# EAGLE design soft_starter_schematics (EAGLE 9.6.2)
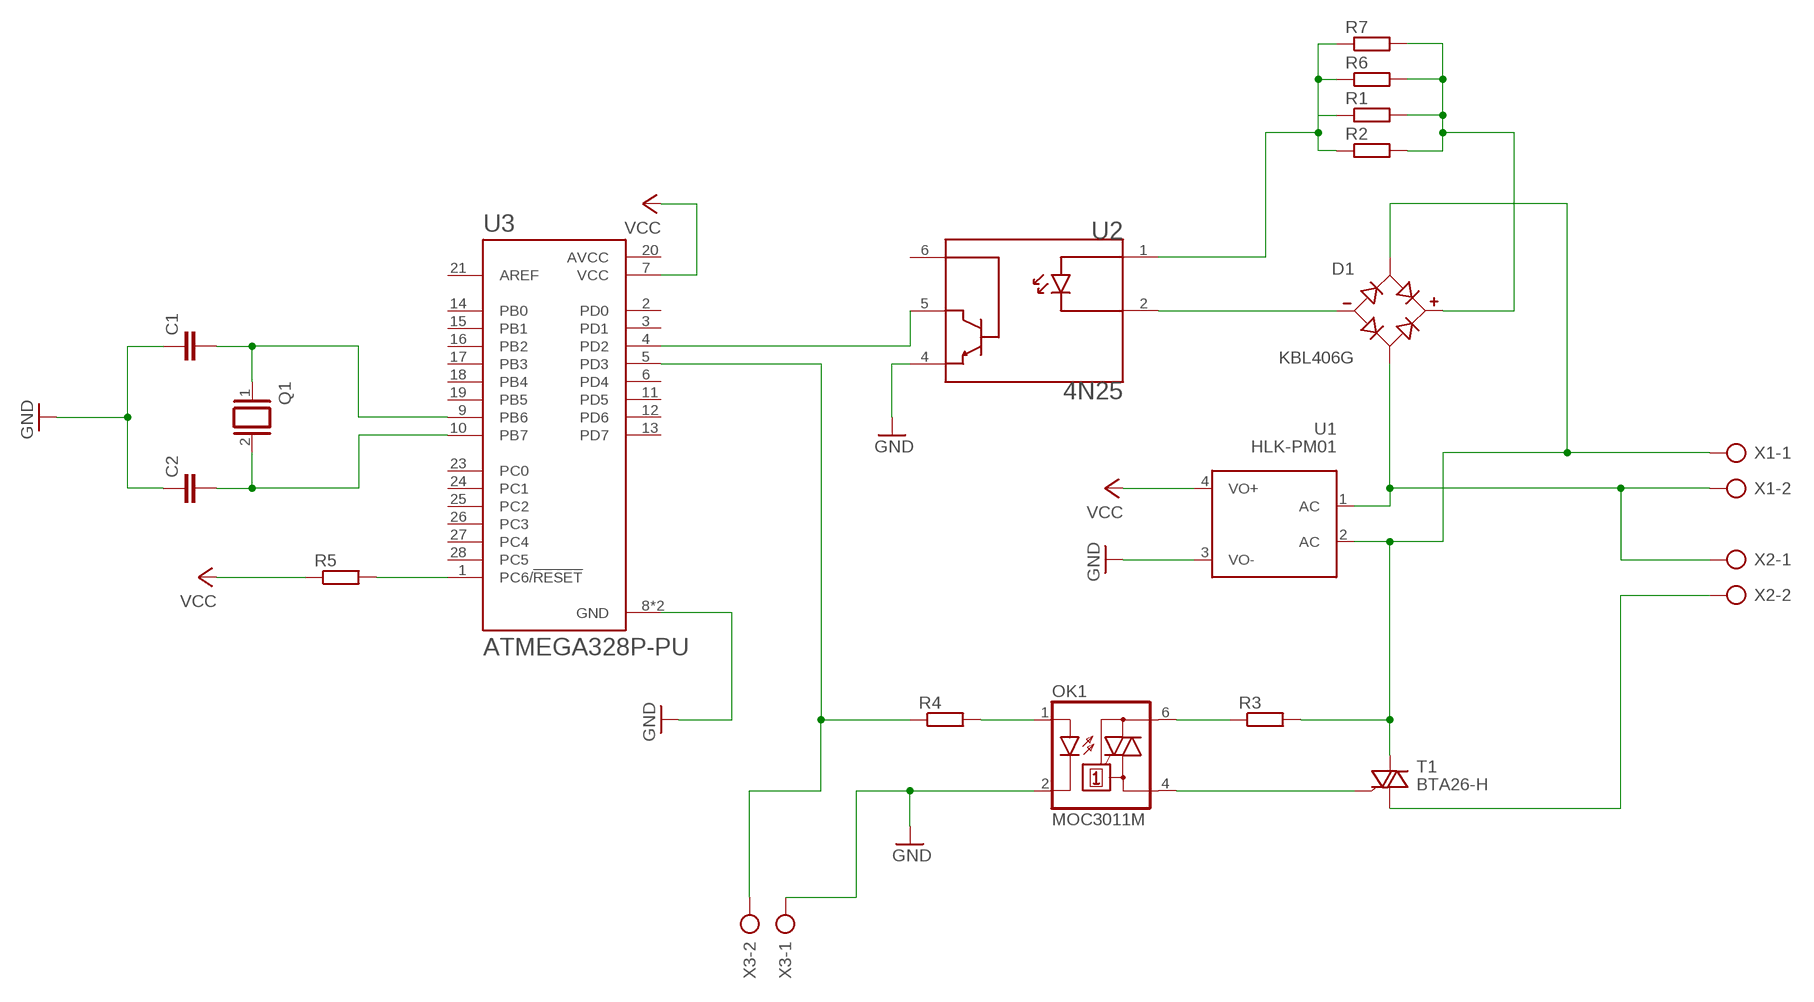
[diagram p0: schematic, sheet 1]

## Parts
C1  C2.5/2  [C2.5-2]
C2  C2.5/2  [C2.5-2]
D1  KBL406G  [SIP600W130P510L1900H1630Q4]
OK1  MOC3011M  [DIL06]
Q1  XTAL/S  [QS]
R1  R-EU_0207/10  [0207/10]
R2  R-EU_0207/10  [0207/10]
R3  R-EU_0207/10  [0207/10]
R4  R-EU_0207/10  [0207/10]
R5  R-EU_0207/10  [0207/10]
R6  R-EU_0207/10  [0207/10]
R7  R-EU_0207/10  [0207/10]
T1  BTA26-H  [TOP3L-1]
U1  HLK-PM01  [HLK-PM01]
U2  4N25  [DIP762W50P254L712H400Q6N]
U3  ATMEGA328P-PU  [DIP794W46P254L2967H457Q28B]
X1  AK300/2  [AK300/2]
X2  AK300/2  [AK300/2]
X3  AK300/2  [AK300/2]

## Nets
GND: C1.1 C2.1 OK1.2(C) U1.3(VO-) U2.4(E) U3.8(GND) U3.22(GND) X3.1
N$1: U2.5(C) U3.4(PD2)
N$2: D1.- U2.2(K)
N$3: D1.+ R1.2 R2.2 R6.2 R7.2
N$4: R1.1 R2.1 R6.1 R7.1 U2.1(A)
N$5: D1.AC2 U1.1(AC) X1.2 X2.1
N$6: R4.1 U3.5(PD3) X3.2
N$7: T1.A1 X2.2
N$8: OK1.4(A1) T1.G
N$9: OK1.6(A2) R3.1
N$10: R5.2 U3.1(PC6/!RESET)
N$11: OK1.1(A) R4.2
N$12: C2.2 Q1.2 U3.10(PB7)
N$13: C1.2 Q1.1 U3.9(PB6)
N$16: D1.AC1 R3.2 T1.A2 U1.2(AC) X1.1
VCC: R5.1 U1.4(VO+) U3.7(VCC)
Unconnected: U2.6(B) U3.2(PD0) U3.3(PD1) U3.6(PD4) U3.11(PD5) U3.12(PD6) U3.13(PD7) U3.14(PB0) U3.15(PB1) U3.16(PB2) U3.17(PB3) U3.18(PB4) U3.19(PB5) U3.21(AREF) U3.23(PC0) U3.24(PC1) U3.25(PC2) U3.26(PC3) U3.27(PC4) U3.28(PC5)

## Power pins joined to a net without a drawn wire
AVCC: U3.20(AVCC)

## Library data of the parts
C1 C2 = capacitor-wima:C: CAPACITOR naming: grid - package width
D1 = KBL406G:KBL406G: Check availability <https://pricing.snapeda.com/parts/KBL406-G/Comchip%20Technology/view-part?ref=eda>; AVAILABILITY: In Stock; DESCRIPTION: Bridge Rectifier Single Phase Standard 600 V Through Hole KBL; MF: Comchip Technology; MP: KBL406-G; PACKAGE: SIP-4 Comchip; PRICE: None; PURCHASE-URL: https://pricing.snapeda.com/search/part/KBL406-G/?ref=eda
OK1 = optocoupler:MOC30*M: RANDOM-PHASE OPTOISOLATORS TRIAC DRIVER OUTPUT Source: http://www.fairchildsemi.com MOC3020-M.pdf; MF: FAIRCHILD SEMICONDUCTOR; MPN: MOC3011-M; OC_FARNELL: 1021363; OC_NEWARK: 72K8893
Q1 = special:XTAL/S: CRYSTAL
R1-R7 = rcl:R-EU_: RESISTOR, European symbol; SPICEPREFIX: R
T1 = triac:BTA26: 25A TRIAC Source: http://www.st.com/stonline/products/literature/ds/7470.pdf
U1 = HLK-PM01:HLK-PM01: Check availability <https://pricing.snapeda.com/parts/hlk-pm01/Hi-link/view-part?ref=eda>; AVAILABILITY: In Stock; DESCRIPTION: The 3W ultra-small series module power supply is a small-volume, high-efficiency AC DC power module supply designed by Shenzhen Hi-Link Electronics Co.,Ltd. It has the advantages of global input voltage range, low temperature rise, low power consumption,high efficiency, high reliability and high safety isolation. It has been widely used in smart home, automation control, communications equipment, instrumentation and other industries.; MF: Hi-link; MP: hlk-pm01; PACKAGE: None; PRICE: None
U2 = 4N25:4N25: Optoisolator, Transistor Output Check availability <https://pricing.snapeda.com/parts/4N25/Vishay%20Semiconductor%20Opto%20Division/view-part?ref=eda>; AVAILABILITY: In Stock; DESCRIPTION: Optoisolator Transistor with Base Output 5000Vrms 1 Channel 6-DIP; MF: Vishay Semiconductor Opto Division; MP: 4N25; PACKAGE: None; PRICE: None; PURCHASE-URL: https://pricing.snapeda.com/search/part/4N25/?ref=eda
U3 = ATMEGA328P-PU:ATMEGA328P-PU: ATmega Series 20 MHz 32 KB Flash 2 KB SRAM 8-Bit Microcontroller - DIP-28 Check availability <https://pricing.snapeda.com/parts/ATMEGA328P-PU/Microchip/view-part?ref=eda>; AVAILABILITY: In Stock; DESCRIPTION: AVR AVR® ATmega Microcontroller IC 8-Bit 20MHz 32KB (16K x 16) FLASH 28-PDIP; MF: Microchip; MP: ATMEGA328P-PU; PACKAGE: PDIP-28 Atmel; PRICE: None; PURCHASE-URL: https://pricing.snapeda.com/search/part/ATMEGA328P-PU/?ref=eda
X1-X3 = con-ptr500:AK300/2: CONNECTOR; OC_FARNELL: unknown; OC_NEWARK: unknown

## Board
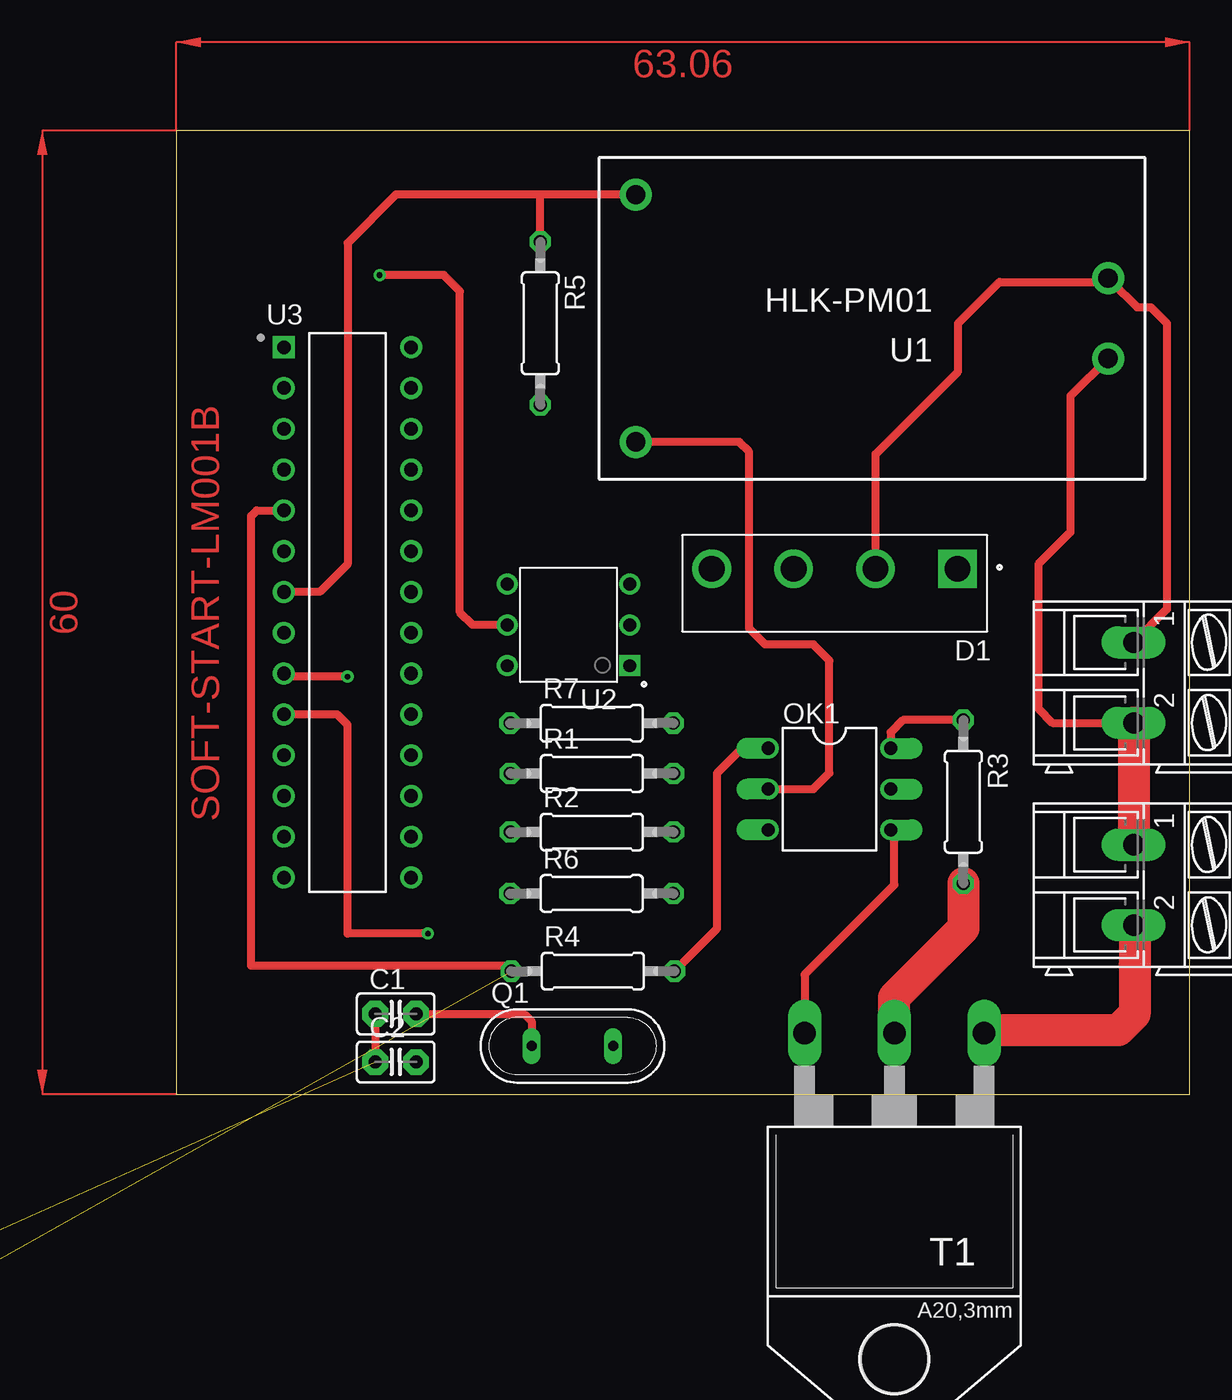
[diagram p1: board, top side]
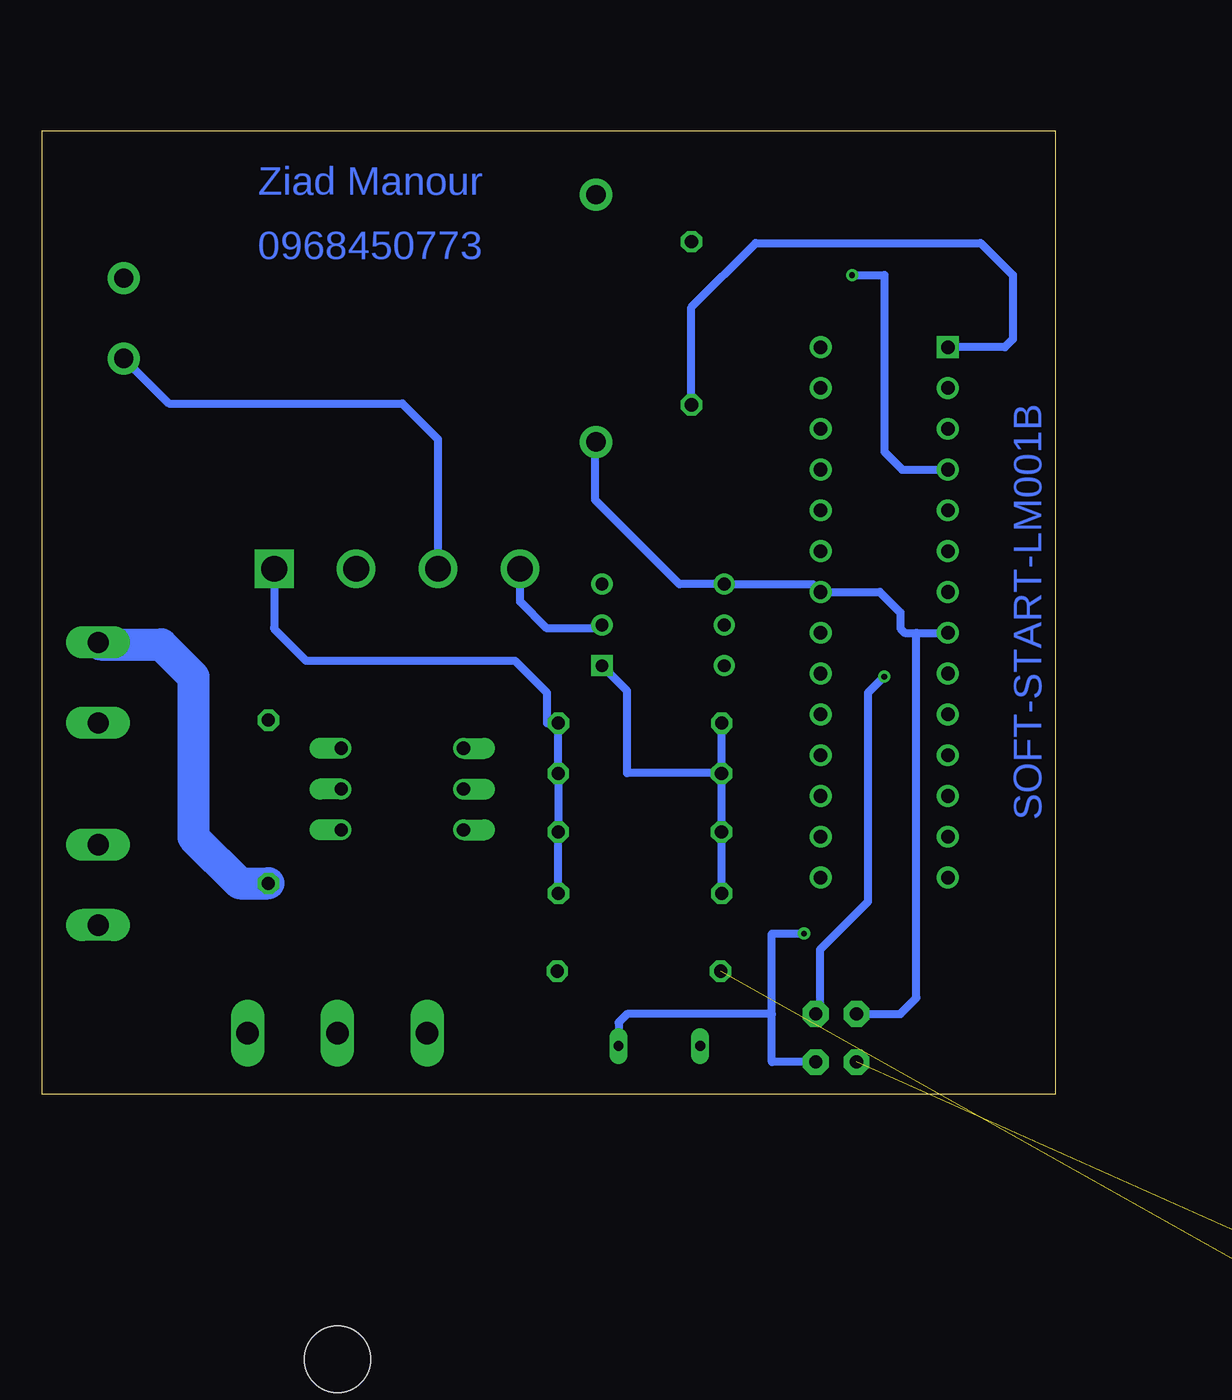
[diagram p2: board, bottom side, seen from below]

Size 63.06 x 60 mm. Coordinates in mm from the lower left corner, seen from the top.
Outline: 0,0 63.06,0 63.06,60 0,60 0,0
Copper layers (1*16): Top 0.035mm / dielectric 1.5mm / Bottom 0.035mm
Design rules "default": minimum track width 6mil, minimum drill 0.35mm, track to track 6mil, track to pad 6mil, pad to pad 6mil, via to via 6mil, smd to smd 6mil, copper to edge 40mil, drill to drill 6mil, minimum pad ring 10mil, minimum via ring 8mil, stop-mask expansion 4mil, vias tented up to drill 0mil, thermal gap 10mil

### Footprints (pad centres in the part's own frame; a part is rotated, then mirrored left to right if it is on the bottom)
C2.5-2 = drill 0.813 pad 1.6 octagon: 1 -1.27,0; 2 1.27,0
SIP600W130P510L1900H1630Q4 = drill 1.6 square: + -7.65,-0.9 | drill 1.6: - 7.65,-0.9; AC1 -2.55,-0.9; AC2 2.55,-0.9
DIL06 = drill 0.813 offset: 1 -2.54,-3.81; 2 0,-3.81; 3 2.54,-3.81; 4 2.54,3.81; 5 0,3.81; 6 -2.54,3.81
QS = drill 0.61 long: 1 -2.54,0; 2 2.54,0
0207/10 = drill 0.813 octagon: 1 -5.08,0; 2 5.08,0
TOP3L-1 = drill 1.397 long: A1 -5.588,-7.62; A2 0,-7.62; G 5.588,-7.62 | hole 4.115: 0,12.7
HLK-PM01 = drill 1.2 pad 2: 1 -14.7,2.5; 2 -14.7,-2.5; 3 14.7,7.7; 4 14.7,-7.7
DIP762W50P254L712H400Q6N = drill 0.8 square: 1 -3.81,2.54 | drill 0.8: 2 -3.81,0; 3 -3.81,-2.54; 4 3.81,-2.54; 5 3.81,0; 6 3.81,2.54
DIP794W46P254L2967H457Q28B = drill 0.85 square: 1 -3.96,16.51 | drill 0.85: 2 -3.96,13.97; 3 -3.96,11.43; 4 -3.96,8.89; 5 -3.96,6.35; 6 -3.96,3.81; 7 -3.96,1.27; 8 -3.96,-1.27; 9 -3.96,-3.81; 10 -3.96,-6.35; 11 -3.96,-8.89; 12 -3.96,-11.43; 13 -3.96,-13.97; 14 -3.96,-16.51; 15 3.96,-16.51; 16 3.96,-13.97; 17 3.96,-11.43; 18 3.96,-8.89; 19 3.96,-6.35; 20 3.96,-3.81; 21 3.96,-1.27; 22 3.96,1.27; 23 3.96,3.81; 24 3.96,6.35; 25 3.96,8.89; 26 3.96,11.43; 27 3.96,13.97; 28 3.96,16.51
AK300/2 = drill 1.321 long: 1 -2.515,0; 2 2.489,0

### Placement (x,y rotation side)
C1  13.65,5 0 top
C2  13.65,2 0 top
D1  40.97,31.81 180 top
OK1  40.65,19 270 top
Q1  24.65,3 0 top
R1  25.86,19.97 0 top
R2  25.86,16.32 0 top
R3  48.98,18.21 270 top
R4  25.92,7.66 0 top
R5  22.65,48 270 top
R6  25.85,12.5 0 top
R7  25.85,23.1 0 top
T1  44.69,-3.81 180 top
U1  43.29,48.31 180 top
U2  24.41,29.22 180 top
U3  10.65,30 0 top
X1  59.58,25.61 270 top
X2  59.58,13.02 270 top
X3  -17.15,-12.3 0 top  (outside the outline)

### Tracks (layer width: path | path; a pad name or v marks a point on that pad's centre or on a via)
GND  (1 unrouted)
  Top 0.5: U1.3 35.04,40.61 35.65,40 35.65,29 36.65,28 39.65,28 40.65,27 40.65,20 39.65,19 OK1.2 | C1.1 C2.1
  Bottom 0.152: 28.65,40.67 U1.3
  Bottom 0.5: 28.65,40.67 28.65,37 23.41,31.76 U2.4 15.1,31.76 U3.22 10.92,31.27 9.65,30 9.65,29 9.38,28.73 8.65,28.73 | 8.65,28.73 U3.8 | C1.1 9.65,5 8.65,6 8.65,28.73
N$1  (via drill 0.35)
  Top 0.5: U2.5 18.43,29.22 17.65,30 17.65,50 16.65,51 v12.65,51
  Bottom 0.5: v12.65,51 10.65,51 10.65,40 9.54,38.89 U3.4
N$2
  Bottom 0.152: U2.2 28.44,29
  Bottom 0.5: 28.44,29 31.65,29 33.32,30.67 D1.-
N$3
  Bottom 0.152: 48.62,29.03 48.65,29
  Bottom 0.5: D1.+ 48.62,29.03 | 48.65,29 46.65,27 33.65,27 31.65,25 31.65,23.1 R7.2 R1.2 R2.2 R6.2
N$4
  Top 0.152: 20.73,16.42 R2.1 20.88,16.27 | 20.88,20.02 R1.1
  Bottom 0.152: R1.1 20.81,20
  Bottom 0.5: 20.81,20 26.65,20 26.65,25.11 U2.1 | R6.1 R2.1 R1.1 R7.1
N$5
  Top 0.152: X2.1 59.55,15.56
  Top 0.5: U1.1 55.65,43.47 55.65,35 53.65,33 53.65,24 54.53,23.12 X1.2
  Top 2: X1.2 X2.1
  Bottom 0.152: 59.55,15.56 X2.1
  Bottom 0.5: D1.AC2 38.42,40.77 40.65,43 55.18,43 U1.1
N$6  (1 unrouted)
  Top 0.5: R4.1 20.5,8 4.65,8 4.65,36 5,36.35 U3.5
N$7
  Top 0.152: T1.A1 50.47,4 | X2.2 59.65,10.46
  Top 2: 50.47,4 58.65,4 59.65,5 59.65,8 59.65,10.46
N$8
  Top 0.152: T1.G 39.15,3.81 | 44.69,16.23 OK1.4
  Top 0.5: T1.G 39.1,7.45 44.69,13.04 44.69,16.23
N$9
  Top 0.5: R3.1 45.22,23.29 44.46,22.53 OK1.6
N$10
  Bottom 0.5: U3.1 3.14,46.51 2.65,47 2.65,51 4.65,53 18.65,53 22.65,49 R5.2
N$11
  Top 0.5: R4.2 33.65,10.31 33.65,20 35.19,21.54 OK1.1
N$12  (via drill 0.35)
  Top 0.5: v15.65,10 10.65,10 10.65,23 10,23.65 U3.10
  Bottom 0.5: C2.2 17.65,2 17.65,5 | 17.65,5 26.65,5 27.19,4.46 Q1.2 | 17.65,5 17.65,10 v15.65,10
N$13  (via drill 0.35)
  Top 0.152: 6.88,26 U3.9
  Top 0.5: C1.2 21.65,5 22.11,4.54 Q1.1 | v10.65,26 6.88,26
  Bottom 0.152: C1.2 14.65,5.27
  Bottom 0.5: 14.65,5.27 14.65,9 11.65,12 11.65,25 v10.65,26
N$16
  Top 0.152: 44.65,3.85 T1.A2 | U1.2 58.23,50.58
  Top 0.5: X1.1 61.65,30.2 61.65,48 60.65,49 59.8,49 58.23,50.58 51.23,50.58 48.65,48 48.65,45 43.52,39.87 D1.AC1
  Top 2: R3.2 48.98,10.33 44.65,6 44.65,3.85
  Bottom 0.152: X1.1 59.46,28
  Bottom 2: 59.46,28 55.65,28 53.65,26 53.65,16 50.78,13.13 R3.2
VCC
  Top 0.5: U1.4 22.65,56.01 | 22.65,56.01 13.66,56.01 10.65,53 10.65,33 8.92,31.27 U3.7 | R5.1 22.65,56.01
(copper drawn outside any net)
  shapes: Top area x2

### Text on the board
Top: SOFT-START-LM001B
Bottom: Ziad Manour | 0968450773 | SOFT-START-LM001B